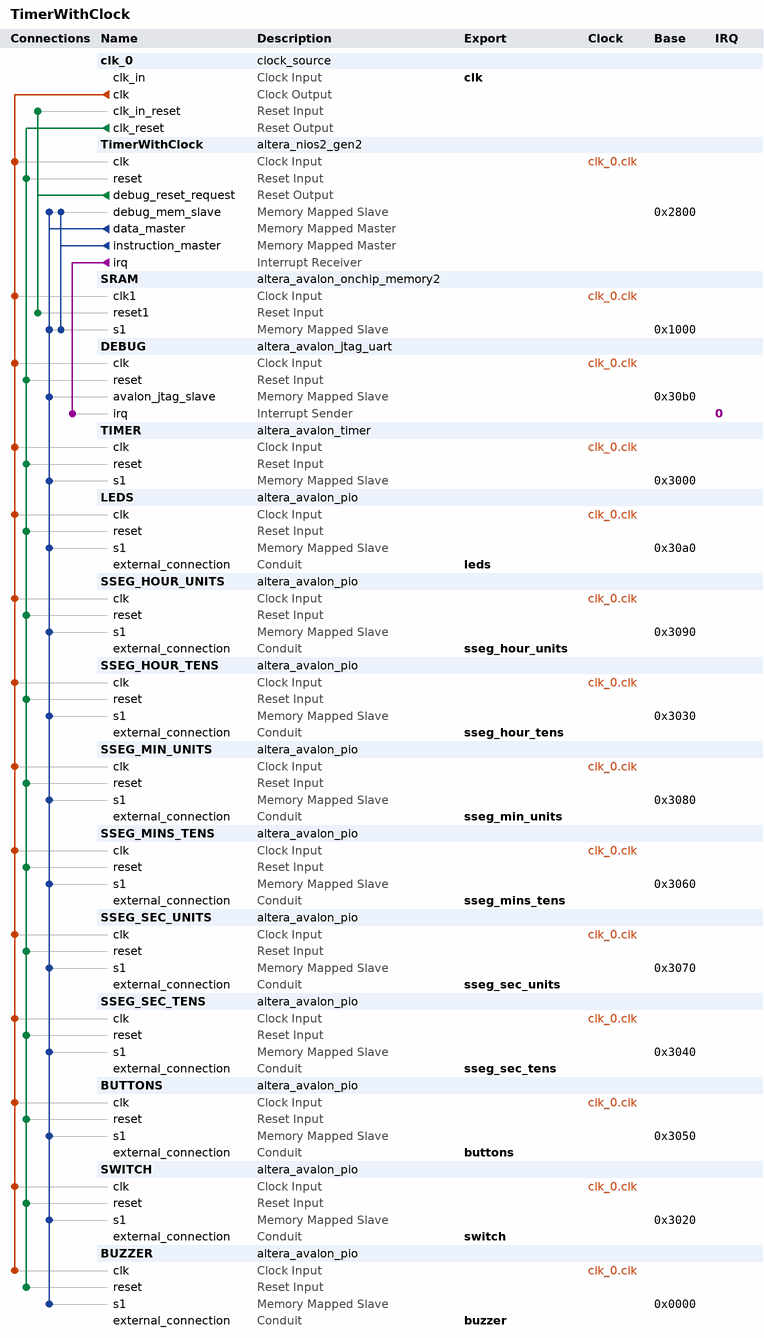
[diagram p0: system contents]
# Platform Designer (Qsys) system TimerWithClock, Cyclone V 5CSXFC6D6F31C6
# Parameters at their usual value, and those the tool derives, are not listed.
package require -exact qsys 23.1
create_system TimerWithClock
set_project_property DEVICE_FAMILY {Cyclone V}
set_project_property DEVICE 5CSXFC6D6F31C6

add_instance clk_0 clock_source 23.1
set_instance_parameter_value clk_0 clockFrequency 50000000

add_instance TimerWithClock altera_nios2_gen2 23.1
set_instance_parameter_value TimerWithClock dcache_size 2048
set_instance_parameter_value TimerWithClock exceptionSlave SRAM.s1
set_instance_parameter_value TimerWithClock icache_size 4096
set_instance_parameter_value TimerWithClock impl Tiny
set_instance_parameter_value TimerWithClock resetSlave SRAM.s1

add_instance SRAM altera_avalon_onchip_memory2 23.1
set_instance_parameter_value SRAM dataWidth 32
set_instance_parameter_value SRAM dualPort false
set_instance_parameter_value SRAM initMemContent true
set_instance_parameter_value SRAM initializationFileName onchip_mem.hex
set_instance_parameter_value SRAM memorySize 4096

add_instance DEBUG altera_avalon_jtag_uart 23.1
set_instance_parameter_value DEBUG simInteractiveOptions NO_INTERACTIVE_WINDOWS

add_instance TIMER altera_avalon_timer 23.1
set_instance_parameter_value TIMER period 50000000
set_instance_parameter_value TIMER periodUnits CLOCKS

add_instance LEDS altera_avalon_pio 23.1
set_instance_parameter_value LEDS direction Output
set_instance_parameter_value LEDS width 10

add_instance SSEG_HOUR_UNITS altera_avalon_pio 23.1
set_instance_parameter_value SSEG_HOUR_UNITS direction Output
set_instance_parameter_value SSEG_HOUR_UNITS width 7

add_instance SSEG_HOUR_TENS altera_avalon_pio 23.1
set_instance_parameter_value SSEG_HOUR_TENS direction Output
set_instance_parameter_value SSEG_HOUR_TENS width 7

add_instance SSEG_MIN_UNITS altera_avalon_pio 23.1
set_instance_parameter_value SSEG_MIN_UNITS direction Output
set_instance_parameter_value SSEG_MIN_UNITS width 7

add_instance SSEG_MINS_TENS altera_avalon_pio 23.1
set_instance_parameter_value SSEG_MINS_TENS direction Output
set_instance_parameter_value SSEG_MINS_TENS width 7

add_instance SSEG_SEC_UNITS altera_avalon_pio 23.1
set_instance_parameter_value SSEG_SEC_UNITS direction Output
set_instance_parameter_value SSEG_SEC_UNITS width 7

add_instance SSEG_SEC_TENS altera_avalon_pio 23.1
set_instance_parameter_value SSEG_SEC_TENS direction Output
set_instance_parameter_value SSEG_SEC_TENS width 7

add_instance BUTTONS altera_avalon_pio 23.1
set_instance_parameter_value BUTTONS direction Input
set_instance_parameter_value BUTTONS width 4

add_instance SWITCH altera_avalon_pio 23.1
set_instance_parameter_value SWITCH direction Input
set_instance_parameter_value SWITCH width 1

add_instance BUZZER altera_avalon_pio 23.1
set_instance_parameter_value BUZZER direction Output
set_instance_parameter_value BUZZER width 1

# connections
add_connection clk_0.clk BUTTONS.clk clock
add_connection clk_0.clk BUZZER.clk clock
add_connection clk_0.clk DEBUG.clk clock
add_connection clk_0.clk LEDS.clk clock
add_connection clk_0.clk SRAM.clk1 clock
add_connection clk_0.clk SSEG_HOUR_TENS.clk clock
add_connection clk_0.clk SSEG_HOUR_UNITS.clk clock
add_connection clk_0.clk SSEG_MIN_UNITS.clk clock
add_connection clk_0.clk SSEG_MINS_TENS.clk clock
add_connection clk_0.clk SSEG_SEC_TENS.clk clock
add_connection clk_0.clk SSEG_SEC_UNITS.clk clock
add_connection clk_0.clk SWITCH.clk clock
add_connection clk_0.clk TIMER.clk clock
add_connection clk_0.clk TimerWithClock.clk clock
add_connection clk_0.clk_reset BUTTONS.reset reset
add_connection clk_0.clk_reset BUZZER.reset reset
add_connection clk_0.clk_reset DEBUG.reset reset
add_connection clk_0.clk_reset LEDS.reset reset
add_connection clk_0.clk_reset SSEG_HOUR_TENS.reset reset
add_connection clk_0.clk_reset SSEG_HOUR_UNITS.reset reset
add_connection clk_0.clk_reset SSEG_MIN_UNITS.reset reset
add_connection clk_0.clk_reset SSEG_MINS_TENS.reset reset
add_connection clk_0.clk_reset SSEG_SEC_TENS.reset reset
add_connection clk_0.clk_reset SSEG_SEC_UNITS.reset reset
add_connection clk_0.clk_reset SWITCH.reset reset
add_connection clk_0.clk_reset TIMER.reset reset
add_connection clk_0.clk_reset TimerWithClock.reset reset
add_connection TimerWithClock.debug_reset_request clk_0.clk_in_reset reset
add_connection TimerWithClock.debug_reset_request SRAM.reset1 reset
add_connection TimerWithClock.data_master BUTTONS.s1 avalon
set_connection_parameter_value TimerWithClock.data_master/BUTTONS.s1 baseAddress 0x3050
add_connection TimerWithClock.data_master BUZZER.s1 avalon
set_connection_parameter_value TimerWithClock.data_master/BUZZER.s1 baseAddress 0x0000
add_connection TimerWithClock.data_master DEBUG.avalon_jtag_slave avalon
set_connection_parameter_value TimerWithClock.data_master/DEBUG.avalon_jtag_slave baseAddress 0x30b0
add_connection TimerWithClock.data_master LEDS.s1 avalon
set_connection_parameter_value TimerWithClock.data_master/LEDS.s1 baseAddress 0x30a0
add_connection TimerWithClock.data_master SRAM.s1 avalon
set_connection_parameter_value TimerWithClock.data_master/SRAM.s1 baseAddress 0x1000
add_connection TimerWithClock.data_master SSEG_HOUR_TENS.s1 avalon
set_connection_parameter_value TimerWithClock.data_master/SSEG_HOUR_TENS.s1 baseAddress 0x3030
add_connection TimerWithClock.data_master SSEG_HOUR_UNITS.s1 avalon
set_connection_parameter_value TimerWithClock.data_master/SSEG_HOUR_UNITS.s1 baseAddress 0x3090
add_connection TimerWithClock.data_master SSEG_MIN_UNITS.s1 avalon
set_connection_parameter_value TimerWithClock.data_master/SSEG_MIN_UNITS.s1 baseAddress 0x3080
add_connection TimerWithClock.data_master SSEG_MINS_TENS.s1 avalon
set_connection_parameter_value TimerWithClock.data_master/SSEG_MINS_TENS.s1 baseAddress 0x3060
add_connection TimerWithClock.data_master SSEG_SEC_TENS.s1 avalon
set_connection_parameter_value TimerWithClock.data_master/SSEG_SEC_TENS.s1 baseAddress 0x3040
add_connection TimerWithClock.data_master SSEG_SEC_UNITS.s1 avalon
set_connection_parameter_value TimerWithClock.data_master/SSEG_SEC_UNITS.s1 baseAddress 0x3070
add_connection TimerWithClock.data_master SWITCH.s1 avalon
set_connection_parameter_value TimerWithClock.data_master/SWITCH.s1 baseAddress 0x3020
add_connection TimerWithClock.data_master TIMER.s1 avalon
set_connection_parameter_value TimerWithClock.data_master/TIMER.s1 baseAddress 0x3000
add_connection TimerWithClock.data_master TimerWithClock.debug_mem_slave avalon
set_connection_parameter_value TimerWithClock.data_master/TimerWithClock.debug_mem_slave baseAddress 0x2800
add_connection TimerWithClock.instruction_master SRAM.s1 avalon
set_connection_parameter_value TimerWithClock.instruction_master/SRAM.s1 baseAddress 0x1000
add_connection TimerWithClock.instruction_master TimerWithClock.debug_mem_slave avalon
set_connection_parameter_value TimerWithClock.instruction_master/TimerWithClock.debug_mem_slave baseAddress 0x2800
add_connection TimerWithClock.irq DEBUG.irq interrupt
set_connection_parameter_value TimerWithClock.irq/DEBUG.irq irqNumber 0

# exported interfaces
add_interface buttons conduit end
set_interface_property buttons EXPORT_OF BUTTONS.external_connection
add_interface buzzer conduit end
set_interface_property buzzer EXPORT_OF BUZZER.external_connection
add_interface clk clock sink
set_interface_property clk EXPORT_OF clk_0.clk_in
add_interface leds conduit end
set_interface_property leds EXPORT_OF LEDS.external_connection
add_interface sseg_hour_tens conduit end
set_interface_property sseg_hour_tens EXPORT_OF SSEG_HOUR_TENS.external_connection
add_interface sseg_hour_units conduit end
set_interface_property sseg_hour_units EXPORT_OF SSEG_HOUR_UNITS.external_connection
add_interface sseg_min_units conduit end
set_interface_property sseg_min_units EXPORT_OF SSEG_MIN_UNITS.external_connection
add_interface sseg_mins_tens conduit end
set_interface_property sseg_mins_tens EXPORT_OF SSEG_MINS_TENS.external_connection
add_interface sseg_sec_tens conduit end
set_interface_property sseg_sec_tens EXPORT_OF SSEG_SEC_TENS.external_connection
add_interface sseg_sec_units conduit end
set_interface_property sseg_sec_units EXPORT_OF SSEG_SEC_UNITS.external_connection
add_interface switch conduit end
set_interface_property switch EXPORT_OF SWITCH.external_connection

set_interconnect_requirement {$system} qsys_mm.clockCrossingAdapter HANDSHAKE
set_interconnect_requirement {$system} qsys_mm.enableEccProtection FALSE
set_interconnect_requirement {$system} qsys_mm.insertDefaultSlave FALSE
set_interconnect_requirement {$system} qsys_mm.maxAdditionalLatency 1

save_system TimerWithClock.qsys
